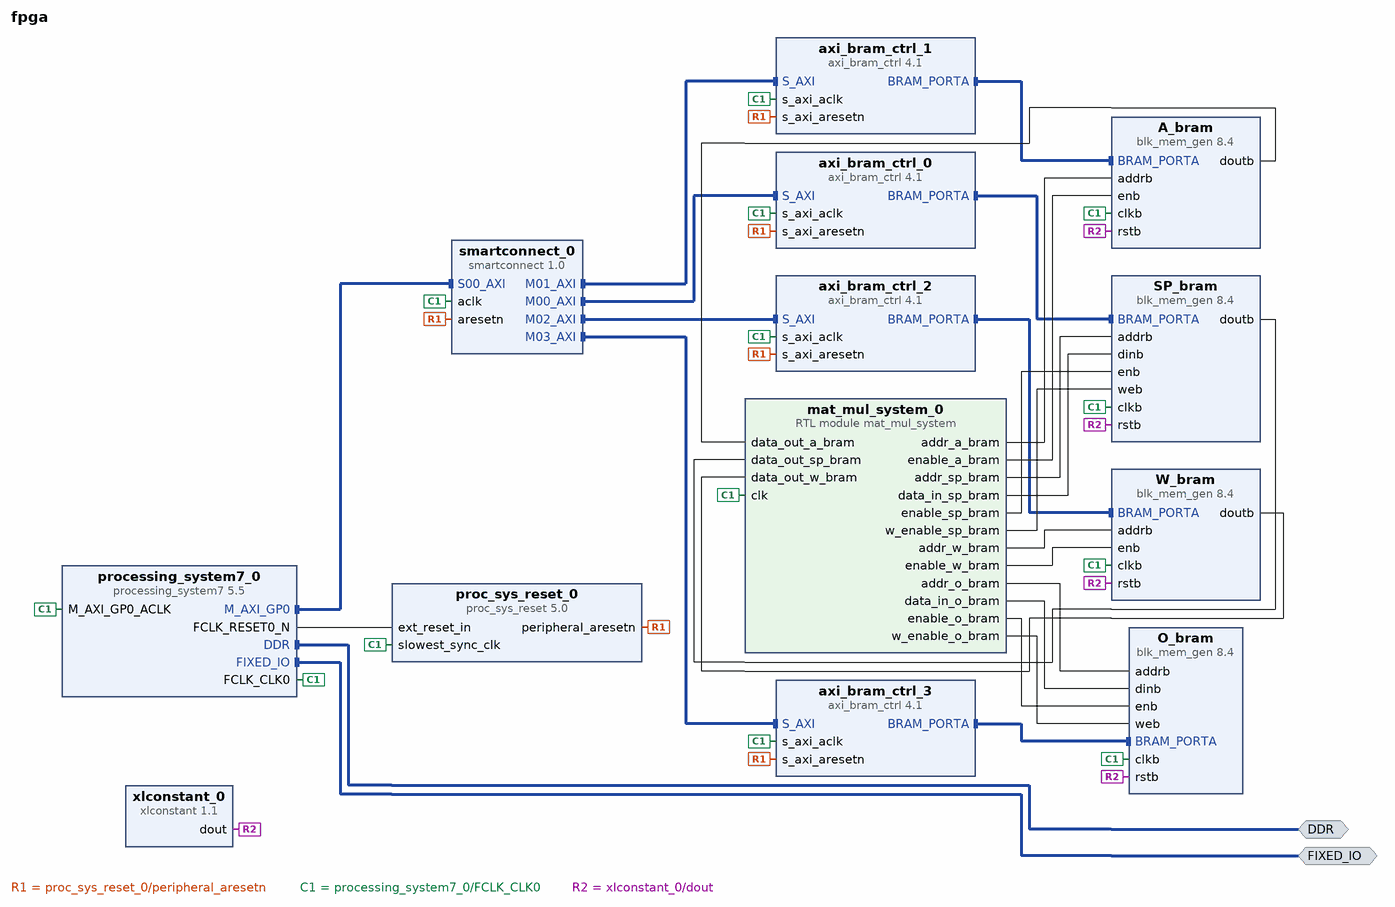
[diagram p0: block diagram of the top level]
# Vivado block design fpga, xc7z020clg400-1, Vivado 2022.2
create_bd_design fpga

create_bd_intf_port -mode Master -vlnv xilinx.com:interface:ddrx_rtl:1.0 DDR
create_bd_intf_port -mode Master -vlnv xilinx.com:display_processing_system7:fixedio_rtl:1.0 FIXED_IO

create_bd_cell -type ip -vlnv xilinx.com:ip:processing_system7:5.5 processing_system7_0
set_property -dict {CONFIG.PCW_FPGA0_PERIPHERAL_FREQMHZ 1} [get_bd_cells processing_system7_0]
# 30 more settings of processing_system7_0 are not shown: defaults, MIO pin electricals, DDR timing, and values the tool derives
create_bd_cell -type ip -vlnv xilinx.com:ip:proc_sys_reset:5.0 proc_sys_reset_0
create_bd_cell -type ip -vlnv xilinx.com:ip:smartconnect:1.0 smartconnect_0
set_property -dict {CONFIG.NUM_MI 4 CONFIG.NUM_SI 1} [get_bd_cells smartconnect_0]
create_bd_cell -type ip -vlnv xilinx.com:ip:axi_bram_ctrl:4.1 axi_bram_ctrl_0
set_property -dict {CONFIG.SINGLE_PORT_BRAM 1} [get_bd_cells axi_bram_ctrl_0]
create_bd_cell -type ip -vlnv xilinx.com:ip:axi_bram_ctrl:4.1 axi_bram_ctrl_1
set_property -dict {CONFIG.SINGLE_PORT_BRAM 1} [get_bd_cells axi_bram_ctrl_1]
create_bd_cell -type ip -vlnv xilinx.com:ip:axi_bram_ctrl:4.1 axi_bram_ctrl_2
set_property -dict {CONFIG.SINGLE_PORT_BRAM 1} [get_bd_cells axi_bram_ctrl_2]
create_bd_cell -type ip -vlnv xilinx.com:ip:axi_bram_ctrl:4.1 axi_bram_ctrl_3
set_property -dict {CONFIG.SINGLE_PORT_BRAM 1} [get_bd_cells axi_bram_ctrl_3]
create_bd_cell -type ip -vlnv xilinx.com:ip:blk_mem_gen:8.4 SP_bram
set_property -dict {CONFIG.Memory_Type True_Dual_Port_RAM} [get_bd_cells SP_bram]
create_bd_cell -type ip -vlnv xilinx.com:ip:blk_mem_gen:8.4 A_bram
set_property -dict {CONFIG.Memory_Type True_Dual_Port_RAM} [get_bd_cells A_bram]
create_bd_cell -type ip -vlnv xilinx.com:ip:blk_mem_gen:8.4 W_bram
set_property -dict {CONFIG.Memory_Type True_Dual_Port_RAM} [get_bd_cells W_bram]
create_bd_cell -type ip -vlnv xilinx.com:ip:blk_mem_gen:8.4 O_bram
set_property -dict {CONFIG.Memory_Type True_Dual_Port_RAM} [get_bd_cells O_bram]
create_bd_cell -type ip -vlnv xilinx.com:ip:xlconstant:1.1 xlconstant_0
set_property -dict {CONFIG.CONST_VAL 0} [get_bd_cells xlconstant_0]
create_bd_cell -type module -reference mat_mul_system mat_mul_system_0

# ---- connections ----

connect_bd_intf_net [get_bd_intf_pins SP_bram/BRAM_PORTA] [get_bd_intf_pins axi_bram_ctrl_0/BRAM_PORTA]
connect_bd_intf_net [get_bd_intf_pins A_bram/BRAM_PORTA] [get_bd_intf_pins axi_bram_ctrl_1/BRAM_PORTA]
connect_bd_intf_net [get_bd_intf_pins W_bram/BRAM_PORTA] [get_bd_intf_pins axi_bram_ctrl_2/BRAM_PORTA]
connect_bd_intf_net [get_bd_intf_pins O_bram/BRAM_PORTA] [get_bd_intf_pins axi_bram_ctrl_3/BRAM_PORTA]
connect_bd_intf_net [get_bd_intf_ports DDR] [get_bd_intf_pins processing_system7_0/DDR]
connect_bd_intf_net [get_bd_intf_ports FIXED_IO] [get_bd_intf_pins processing_system7_0/FIXED_IO]
connect_bd_intf_net [get_bd_intf_pins processing_system7_0/M_AXI_GP0] [get_bd_intf_pins smartconnect_0/S00_AXI]
connect_bd_intf_net [get_bd_intf_pins smartconnect_0/M00_AXI] [get_bd_intf_pins axi_bram_ctrl_0/S_AXI]
connect_bd_intf_net [get_bd_intf_pins smartconnect_0/M01_AXI] [get_bd_intf_pins axi_bram_ctrl_1/S_AXI]
connect_bd_intf_net [get_bd_intf_pins smartconnect_0/M02_AXI] [get_bd_intf_pins axi_bram_ctrl_2/S_AXI]
connect_bd_intf_net [get_bd_intf_pins smartconnect_0/M03_AXI] [get_bd_intf_pins axi_bram_ctrl_3/S_AXI]
connect_bd_net [get_bd_pins A_bram/doutb] [get_bd_pins mat_mul_system_0/data_out_a_bram]
connect_bd_net [get_bd_pins SP_bram/doutb] [get_bd_pins mat_mul_system_0/data_out_sp_bram]
connect_bd_net [get_bd_pins W_bram/doutb] [get_bd_pins mat_mul_system_0/data_out_w_bram]
connect_bd_net [get_bd_pins mat_mul_system_0/addr_a_bram] [get_bd_pins A_bram/addrb]
connect_bd_net [get_bd_pins mat_mul_system_0/addr_o_bram] [get_bd_pins O_bram/addrb]
connect_bd_net [get_bd_pins mat_mul_system_0/addr_sp_bram] [get_bd_pins SP_bram/addrb]
connect_bd_net [get_bd_pins mat_mul_system_0/addr_w_bram] [get_bd_pins W_bram/addrb]
connect_bd_net [get_bd_pins mat_mul_system_0/data_in_o_bram] [get_bd_pins O_bram/dinb]
connect_bd_net [get_bd_pins mat_mul_system_0/data_in_sp_bram] [get_bd_pins SP_bram/dinb]
connect_bd_net [get_bd_pins mat_mul_system_0/enable_a_bram] [get_bd_pins A_bram/enb]
connect_bd_net [get_bd_pins mat_mul_system_0/enable_o_bram] [get_bd_pins O_bram/enb]
connect_bd_net [get_bd_pins mat_mul_system_0/enable_sp_bram] [get_bd_pins SP_bram/enb]
connect_bd_net [get_bd_pins mat_mul_system_0/enable_w_bram] [get_bd_pins W_bram/enb]
connect_bd_net [get_bd_pins mat_mul_system_0/w_enable_o_bram] [get_bd_pins O_bram/web]
connect_bd_net [get_bd_pins mat_mul_system_0/w_enable_sp_bram] [get_bd_pins SP_bram/web]
connect_bd_net [get_bd_pins proc_sys_reset_0/peripheral_aresetn] \
  [get_bd_pins axi_bram_ctrl_0/s_axi_aresetn] [get_bd_pins smartconnect_0/aresetn] \
  [get_bd_pins axi_bram_ctrl_1/s_axi_aresetn] [get_bd_pins axi_bram_ctrl_2/s_axi_aresetn] \
  [get_bd_pins axi_bram_ctrl_3/s_axi_aresetn]
connect_bd_net [get_bd_pins processing_system7_0/FCLK_CLK0] \
  [get_bd_pins proc_sys_reset_0/slowest_sync_clk] [get_bd_pins processing_system7_0/M_AXI_GP0_ACLK] \
  [get_bd_pins smartconnect_0/aclk] [get_bd_pins axi_bram_ctrl_0/s_axi_aclk] [get_bd_pins axi_bram_ctrl_1/s_axi_aclk] \
  [get_bd_pins axi_bram_ctrl_2/s_axi_aclk] [get_bd_pins axi_bram_ctrl_3/s_axi_aclk] [get_bd_pins SP_bram/clkb] \
  [get_bd_pins A_bram/clkb] [get_bd_pins W_bram/clkb] [get_bd_pins O_bram/clkb] [get_bd_pins mat_mul_system_0/clk]
connect_bd_net [get_bd_pins processing_system7_0/FCLK_RESET0_N] [get_bd_pins proc_sys_reset_0/ext_reset_in]
connect_bd_net [get_bd_pins xlconstant_0/dout] \
  [get_bd_pins A_bram/rstb] [get_bd_pins W_bram/rstb] [get_bd_pins O_bram/rstb] [get_bd_pins SP_bram/rstb]
set_property HDL_ATTRIBUTE.BMM_INFO_PROCESSOR {arm > fpga axi_bram_ctrl_0 fpga axi_bram_ctrl_1 fpga axi_bram_ctrl_2 fpga axi_bram_ctrl_3} [get_bd_cells processing_system7_0]
set_property HDL_ATTRIBUTE.KEEP_HIERARCHY yes [get_bd_cells processing_system7_0]
set_property HDL_ATTRIBUTE.BMM_INFO_ADDRESS_SPACE {byte  0x40000000 32 > fpga SP_bram} [get_bd_cells axi_bram_ctrl_0]
set_property HDL_ATTRIBUTE.KEEP_HIERARCHY yes [get_bd_cells axi_bram_ctrl_0]
set_property HDL_ATTRIBUTE.BMM_INFO_ADDRESS_SPACE {byte  0x42000000 32 > fpga A_bram} [get_bd_cells axi_bram_ctrl_1]
set_property HDL_ATTRIBUTE.KEEP_HIERARCHY yes [get_bd_cells axi_bram_ctrl_1]
set_property HDL_ATTRIBUTE.BMM_INFO_ADDRESS_SPACE {byte  0x44000000 32 > fpga W_bram} [get_bd_cells axi_bram_ctrl_2]
set_property HDL_ATTRIBUTE.KEEP_HIERARCHY yes [get_bd_cells axi_bram_ctrl_2]
set_property HDL_ATTRIBUTE.BMM_INFO_ADDRESS_SPACE {byte  0x46000000 32 > fpga O_bram} [get_bd_cells axi_bram_ctrl_3]
set_property HDL_ATTRIBUTE.KEEP_HIERARCHY yes [get_bd_cells axi_bram_ctrl_3]

# ---- address map ----
assign_bd_address -offset 0x40000000 -range 8K -target_address_space [get_bd_addr_spaces processing_system7_0/Data] [get_bd_addr_segs axi_bram_ctrl_0/S_AXI/Mem0]
assign_bd_address -offset 0x42000000 -range 8K -target_address_space [get_bd_addr_spaces processing_system7_0/Data] [get_bd_addr_segs axi_bram_ctrl_1/S_AXI/Mem0]
assign_bd_address -offset 0x44000000 -range 8K -target_address_space [get_bd_addr_spaces processing_system7_0/Data] [get_bd_addr_segs axi_bram_ctrl_2/S_AXI/Mem0]
assign_bd_address -offset 0x46000000 -range 8K -target_address_space [get_bd_addr_spaces processing_system7_0/Data] [get_bd_addr_segs axi_bram_ctrl_3/S_AXI/Mem0]

validate_bd_design
save_bd_design
